# EAGLE schematic MRRobotBadge (EAGLE 9.0.0)

## Sheet 1 of 4
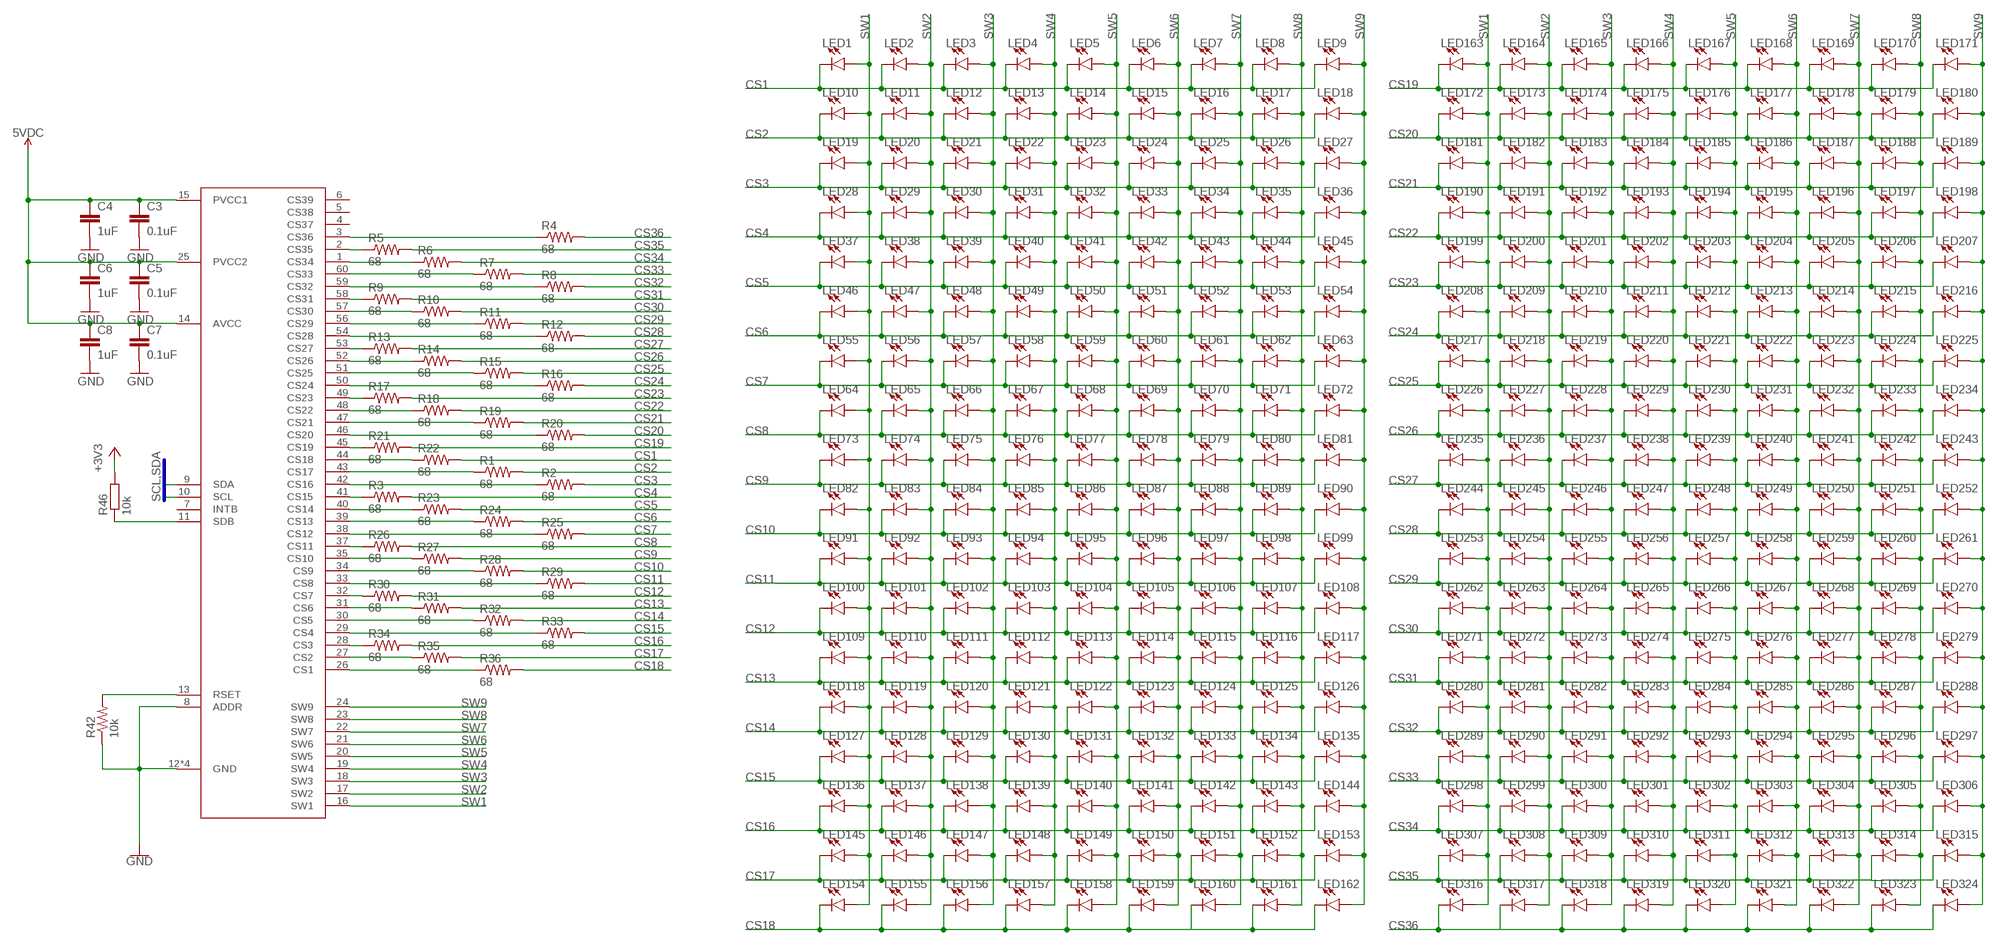
[diagram p0: schematic, sheet 1]

### Parts
C3  0.1uF  C-EUC0805K  [C0805K]
C4  1uF  C-EUC0805K  [C0805K]
C5  0.1uF  C-EUC0805K  [C0805K]
C6  1uF  C-EUC0805K  [C0805K]
C7  0.1uF  C-EUC0805K  [C0805K]
C8  1uF  C-EUC0805K  [C0805K]
LED1  LED0603  [LED-0603]
LED2  LED0603  [LED-0603]
LED3  LED0603  [LED-0603]
LED4  LED0603  [LED-0603]
LED5  LED0603  [LED-0603]
LED6  LED0603  [LED-0603]
LED7  LED0603  [LED-0603]
LED8  LED0603  [LED-0603]
LED9  LED0603  [LED-0603]
LED10  LED0603  [LED-0603]
LED11  LED0603  [LED-0603]
LED12  LED0603  [LED-0603]
LED13  LED0603  [LED-0603]
LED14  LED0603  [LED-0603]
LED15  LED0603  [LED-0603]
LED16  LED0603  [LED-0603]
LED17  LED0603  [LED-0603]
LED18  LED0603  [LED-0603]
LED19  LED0603  [LED-0603]
LED20  LED0603  [LED-0603]
LED21  LED0603  [LED-0603]
LED22  LED0603  [LED-0603]
LED23  LED0603  [LED-0603]
LED24  LED0603  [LED-0603]
LED25  LED0603  [LED-0603]
LED26  LED0603  [LED-0603]
LED27  LED0603  [LED-0603]
LED28  LED0603  [LED-0603]
LED29  LED0603  [LED-0603]
LED30  LED0603  [LED-0603]
LED31  LED0603  [LED-0603]
LED32  LED0603  [LED-0603]
LED33  LED0603  [LED-0603]
LED34  LED0603  [LED-0603]
LED35  LED0603  [LED-0603]
LED36  LED0603  [LED-0603]
LED37  LED0603  [LED-0603]
LED38  LED0603  [LED-0603]
LED39  LED0603  [LED-0603]
LED40  LED0603  [LED-0603]
LED41  LED0603  [LED-0603]
LED42  LED0603  [LED-0603]
LED43  LED0603  [LED-0603]
LED44  LED0603  [LED-0603]
LED45  LED0603  [LED-0603]
LED46  LED0603  [LED-0603]
LED47  LED0603  [LED-0603]
LED48  LED0603  [LED-0603]
LED49  LED0603  [LED-0603]
LED50  LED0603  [LED-0603]
LED51  LED0603  [LED-0603]
LED52  LED0603  [LED-0603]
LED53  LED0603  [LED-0603]
LED54  LED0603  [LED-0603]
LED55  LED0603  [LED-0603]
LED56  LED0603  [LED-0603]
LED57  LED0603  [LED-0603]
LED58  LED0603  [LED-0603]
LED59  LED0603  [LED-0603]
LED60  LED0603  [LED-0603]
LED61  LED0603  [LED-0603]
LED62  LED0603  [LED-0603]
LED63  LED0603  [LED-0603]
LED64  LED0603  [LED-0603]
LED65  LED0603  [LED-0603]
LED66  LED0603  [LED-0603]
LED67  LED0603  [LED-0603]
LED68  LED0603  [LED-0603]
LED69  LED0603  [LED-0603]
LED70  LED0603  [LED-0603]
LED71  LED0603  [LED-0603]
LED72  LED0603  [LED-0603]
LED73  LED0603  [LED-0603]
LED74  LED0603  [LED-0603]
LED75  LED0603  [LED-0603]
LED76  LED0603  [LED-0603]
LED77  LED0603  [LED-0603]
LED78  LED0603  [LED-0603]
LED79  LED0603  [LED-0603]
LED80  LED0603  [LED-0603]
LED81  LED0603  [LED-0603]
LED82  LED0603  [LED-0603]
LED83  LED0603  [LED-0603]
LED84  LED0603  [LED-0603]
LED85  LED0603  [LED-0603]
LED86  LED0603  [LED-0603]
LED87  LED0603  [LED-0603]
LED88  LED0603  [LED-0603]
LED89  LED0603  [LED-0603]
LED90  LED0603  [LED-0603]
LED91  LED0603  [LED-0603]
LED92  LED0603  [LED-0603]
LED93  LED0603  [LED-0603]
LED94  LED0603  [LED-0603]
LED95  LED0603  [LED-0603]
LED96  LED0603  [LED-0603]
LED97  LED0603  [LED-0603]
LED98  LED0603  [LED-0603]
LED99  LED0603  [LED-0603]
LED100  LED0603  [LED-0603]
LED101  LED0603  [LED-0603]
LED102  LED0603  [LED-0603]
LED103  LED0603  [LED-0603]
LED104  LED0603  [LED-0603]
LED105  LED0603  [LED-0603]
LED106  LED0603  [LED-0603]
LED107  LED0603  [LED-0603]
LED108  LED0603  [LED-0603]
LED109  LED0603  [LED-0603]
LED110  LED0603  [LED-0603]
LED111  LED0603  [LED-0603]
LED112  LED0603  [LED-0603]
LED113  LED0603  [LED-0603]
LED114  LED0603  [LED-0603]
LED115  LED0603  [LED-0603]
LED116  LED0603  [LED-0603]
LED117  LED0603  [LED-0603]
LED118  LED0603  [LED-0603]
LED119  LED0603  [LED-0603]
LED120  LED0603  [LED-0603]
LED121  LED0603  [LED-0603]
LED122  LED0603  [LED-0603]
LED123  LED0603  [LED-0603]
LED124  LED0603  [LED-0603]
LED125  LED0603  [LED-0603]
LED126  LED0603  [LED-0603]
LED127  LED0603  [LED-0603]
LED128  LED0603  [LED-0603]
LED129  LED0603  [LED-0603]
LED130  LED0603  [LED-0603]
LED131  LED0603  [LED-0603]
LED132  LED0603  [LED-0603]
LED133  LED0603  [LED-0603]
LED134  LED0603  [LED-0603]
LED135  LED0603  [LED-0603]
LED136  LED0603  [LED-0603]
LED137  LED0603  [LED-0603]
LED138  LED0603  [LED-0603]
LED139  LED0603  [LED-0603]
LED140  LED0603  [LED-0603]
LED141  LED0603  [LED-0603]
LED142  LED0603  [LED-0603]
LED143  LED0603  [LED-0603]
LED144  LED0603  [LED-0603]
LED145  LED0603  [LED-0603]
LED146  LED0603  [LED-0603]
LED147  LED0603  [LED-0603]
LED148  LED0603  [LED-0603]
LED149  LED0603  [LED-0603]
LED150  LED0603  [LED-0603]
LED151  LED0603  [LED-0603]
LED152  LED0603  [LED-0603]
LED153  LED0603  [LED-0603]
LED154  LED0603  [LED-0603]
LED155  LED0603  [LED-0603]
LED156  LED0603  [LED-0603]
LED157  LED0603  [LED-0603]
LED158  LED0603  [LED-0603]
LED159  LED0603  [LED-0603]
LED160  LED0603  [LED-0603]
LED161  LED0603  [LED-0603]
LED162  LED0603  [LED-0603]
LED163  LED0603  [LED-0603]
LED164  LED0603  [LED-0603]
LED165  LED0603  [LED-0603]
LED166  LED0603  [LED-0603]
LED167  LED0603  [LED-0603]
LED168  LED0603  [LED-0603]
LED169  LED0603  [LED-0603]
LED170  LED0603  [LED-0603]
LED171  LED0603  [LED-0603]
LED172  LED0603  [LED-0603]
LED173  LED0603  [LED-0603]
LED174  LED0603  [LED-0603]
LED175  LED0603  [LED-0603]
LED176  LED0603  [LED-0603]
LED177  LED0603  [LED-0603]
LED178  LED0603  [LED-0603]
LED179  LED0603  [LED-0603]
LED180  LED0603  [LED-0603]
LED181  LED0603  [LED-0603]
LED182  LED0603  [LED-0603]
LED183  LED0603  [LED-0603]
LED184  LED0603  [LED-0603]
LED185  LED0603  [LED-0603]
LED186  LED0603  [LED-0603]
LED187  LED0603  [LED-0603]
LED188  LED0603  [LED-0603]
LED189  LED0603  [LED-0603]
LED190  LED0603  [LED-0603]
LED191  LED0603  [LED-0603]
LED192  LED0603  [LED-0603]
LED193  LED0603  [LED-0603]
LED194  LED0603  [LED-0603]
LED195  LED0603  [LED-0603]
LED196  LED0603  [LED-0603]
LED197  LED0603  [LED-0603]
LED198  LED0603  [LED-0603]
LED199  LED0603  [LED-0603]
LED200  LED0603  [LED-0603]
LED201  LED0603  [LED-0603]
LED202  LED0603  [LED-0603]
LED203  LED0603  [LED-0603]
LED204  LED0603  [LED-0603]
LED205  LED0603  [LED-0603]
LED206  LED0603  [LED-0603]
LED207  LED0603  [LED-0603]
LED208  LED0603  [LED-0603]
LED209  LED0603  [LED-0603]
LED210  LED0603  [LED-0603]
LED211  LED0603  [LED-0603]
LED212  LED0603  [LED-0603]
LED213  LED0603  [LED-0603]
LED214  LED0603  [LED-0603]
LED215  LED0603  [LED-0603]
LED216  LED0603  [LED-0603]
LED217  LED0603  [LED-0603]
LED218  LED0603  [LED-0603]
LED219  LED0603  [LED-0603]
LED220  LED0603  [LED-0603]
LED221  LED0603  [LED-0603]
LED222  LED0603  [LED-0603]
LED223  LED0603  [LED-0603]
LED224  LED0603  [LED-0603]
LED225  LED0603  [LED-0603]
LED226  LED0603  [LED-0603]
LED227  LED0603  [LED-0603]
LED228  LED0603  [LED-0603]
LED229  LED0603  [LED-0603]
LED230  LED0603  [LED-0603]
LED231  LED0603  [LED-0603]
LED232  LED0603  [LED-0603]
LED233  LED0603  [LED-0603]
LED234  LED0603  [LED-0603]
LED235  LED0603  [LED-0603]
LED236  LED0603  [LED-0603]
LED237  LED0603  [LED-0603]
LED238  LED0603  [LED-0603]
LED239  LED0603  [LED-0603]
LED240  LED0603  [LED-0603]
LED241  LED0603  [LED-0603]
LED242  LED0603  [LED-0603]
LED243  LED0603  [LED-0603]
LED244  LED0603  [LED-0603]
LED245  LED0603  [LED-0603]
LED246  LED0603  [LED-0603]
LED247  LED0603  [LED-0603]
LED248  LED0603  [LED-0603]
LED249  LED0603  [LED-0603]
LED250  LED0603  [LED-0603]
LED251  LED0603  [LED-0603]
LED252  LED0603  [LED-0603]
LED253  LED0603  [LED-0603]
LED254  LED0603  [LED-0603]
LED255  LED0603  [LED-0603]
LED256  LED0603  [LED-0603]
LED257  LED0603  [LED-0603]
LED258  LED0603  [LED-0603]
LED259  LED0603  [LED-0603]
LED260  LED0603  [LED-0603]
LED261  LED0603  [LED-0603]
LED262  LED0603  [LED-0603]
LED263  LED0603  [LED-0603]
LED264  LED0603  [LED-0603]
LED265  LED0603  [LED-0603]
LED266  LED0603  [LED-0603]
LED267  LED0603  [LED-0603]
LED268  LED0603  [LED-0603]
LED269  LED0603  [LED-0603]
LED270  LED0603  [LED-0603]
LED271  LED0603  [LED-0603]
LED272  LED0603  [LED-0603]
LED273  LED0603  [LED-0603]
LED274  LED0603  [LED-0603]
LED275  LED0603  [LED-0603]
LED276  LED0603  [LED-0603]
LED277  LED0603  [LED-0603]
LED278  LED0603  [LED-0603]
LED279  LED0603  [LED-0603]
LED280  LED0603  [LED-0603]
LED281  LED0603  [LED-0603]
LED282  LED0603  [LED-0603]
LED283  LED0603  [LED-0603]
LED284  LED0603  [LED-0603]
LED285  LED0603  [LED-0603]
LED286  LED0603  [LED-0603]
LED287  LED0603  [LED-0603]
LED288  LED0603  [LED-0603]
LED289  LED0603  [LED-0603]
LED290  LED0603  [LED-0603]
LED291  LED0603  [LED-0603]
LED292  LED0603  [LED-0603]
LED293  LED0603  [LED-0603]
LED294  LED0603  [LED-0603]
LED295  LED0603  [LED-0603]
LED296  LED0603  [LED-0603]
LED297  LED0603  [LED-0603]
LED298  LED0603  [LED-0603]
LED299  LED0603  [LED-0603]
LED300  LED0603  [LED-0603]
LED301  LED0603  [LED-0603]
LED302  LED0603  [LED-0603]
LED303  LED0603  [LED-0603]
LED304  LED0603  [LED-0603]
LED305  LED0603  [LED-0603]
LED306  LED0603  [LED-0603]
LED307  LED0603  [LED-0603]
LED308  LED0603  [LED-0603]
LED309  LED0603  [LED-0603]
LED310  LED0603  [LED-0603]
LED311  LED0603  [LED-0603]
LED312  LED0603  [LED-0603]
LED313  LED0603  [LED-0603]
LED314  LED0603  [LED-0603]
LED315  LED0603  [LED-0603]
LED316  LED0603  [LED-0603]
LED317  LED0603  [LED-0603]
LED318  LED0603  [LED-0603]
LED319  LED0603  [LED-0603]
LED320  LED0603  [LED-0603]
LED321  LED0603  [LED-0603]
LED322  LED0603  [LED-0603]
LED323  LED0603  [LED-0603]
LED324  LED0603  [LED-0603]
R1  68  R-US_R0805  [R0805]
R2  68  R-US_R0805  [R0805]
R3  68  R-US_R0805  [R0805]
R4  68  R-US_R0805  [R0805]
R5  68  R-US_R0805  [R0805]
R6  68  R-US_R0805  [R0805]
R7  68  R-US_R0805  [R0805]
R8  68  R-US_R0805  [R0805]
R9  68  R-US_R0805  [R0805]
R10  68  R-US_R0805  [R0805]
R11  68  R-US_R0805  [R0805]
R12  68  R-US_R0805  [R0805]
R13  68  R-US_R0805  [R0805]
R14  68  R-US_R0805  [R0805]
R15  68  R-US_R0805  [R0805]
R16  68  R-US_R0805  [R0805]
R17  68  R-US_R0805  [R0805]
R18  68  R-US_R0805  [R0805]
R19  68  R-US_R0805  [R0805]
R20  68  R-US_R0805  [R0805]
R21  68  R-US_R0805  [R0805]
R22  68  R-US_R0805  [R0805]
R23  68  R-US_R0805  [R0805]
R24  68  R-US_R0805  [R0805]
R25  68  R-US_R0805  [R0805]
R26  68  R-US_R0805  [R0805]
R27  68  R-US_R0805  [R0805]
R28  68  R-US_R0805  [R0805]
R29  68  R-US_R0805  [R0805]
R30  68  R-US_R0805  [R0805]
R31  68  R-US_R0805  [R0805]
R32  68  R-US_R0805  [R0805]
R33  68  R-US_R0805  [R0805]
R34  68  R-US_R0805  [R0805]
R35  68  R-US_R0805  [R0805]
R36  68  R-US_R0805  [R0805]
R42  10k  R-US_R0805  [R0805]
R46  10k  R-EU_R0805  [R0805]
U1  IS31FL3741_QFN60  [QFN60]

### Nets
3V3: R46.2 ; supply symbol labelled +3V3 ; also sheet 2,3
5VDC: C3.1 C4.1 C5.1 C6.1 C7.1 C8.1 U1.14(AVCC) U1.15(PVCC1) U1.25(PVCC2) ; also sheet 2
CS1: LED1.C LED2.C LED3.C LED4.C LED5.C LED6.C LED7.C LED8.C LED9.C R22.2
CS2: LED10.C LED11.C LED12.C LED13.C LED14.C LED15.C LED16.C LED17.C LED18.C R1.2
CS3: LED19.C LED20.C LED21.C LED22.C LED23.C LED24.C LED25.C LED26.C LED27.C R2.2
CS4: LED28.C LED29.C LED30.C LED31.C LED32.C LED33.C LED34.C LED35.C LED36.C R3.2
CS5: LED37.C LED38.C LED39.C LED40.C LED41.C LED42.C LED43.C LED44.C LED45.C R23.2
CS6: LED46.C LED47.C LED48.C LED49.C LED50.C LED51.C LED52.C LED53.C LED54.C R24.2
CS7: LED55.C LED56.C LED57.C LED58.C LED59.C LED60.C LED61.C LED62.C LED63.C R25.2
CS8: LED64.C LED65.C LED66.C LED67.C LED68.C LED69.C LED70.C LED71.C LED72.C R26.2
CS9: LED73.C LED74.C LED75.C LED76.C LED77.C LED78.C LED79.C LED80.C LED81.C R27.2
CS10: LED82.C LED83.C LED84.C LED85.C LED86.C LED87.C LED88.C LED89.C LED90.C R28.2
CS11: LED91.C LED92.C LED93.C LED94.C LED95.C LED96.C LED97.C LED98.C LED99.C R29.2
CS12: LED100.C LED101.C LED102.C LED103.C LED104.C LED105.C LED106.C LED107.C LED108.C R30.2
CS13: LED109.C LED110.C LED111.C LED112.C LED113.C LED114.C LED115.C LED116.C LED117.C R31.2
CS14: LED118.C LED119.C LED120.C LED121.C LED122.C LED123.C LED124.C LED125.C LED126.C R32.2
CS15: LED127.C LED128.C LED129.C LED130.C LED131.C LED132.C LED133.C LED134.C LED135.C R33.2
CS16: LED136.C LED137.C LED138.C LED139.C LED140.C LED141.C LED142.C LED143.C LED144.C R34.2
CS17: LED145.C LED146.C LED147.C LED148.C LED149.C LED150.C LED151.C LED152.C LED153.C R35.2
CS18: LED154.C LED155.C LED156.C LED157.C LED158.C LED159.C LED160.C LED161.C LED162.C R36.2
CS19: LED163.C LED164.C LED165.C LED166.C LED167.C LED168.C LED169.C LED170.C LED171.C R21.2
CS20: LED172.C LED173.C LED174.C LED175.C LED176.C LED177.C LED178.C LED179.C LED180.C R20.2
CS21: LED181.C LED182.C LED183.C LED184.C LED185.C LED186.C LED187.C LED188.C LED189.C R19.2
CS22: LED190.C LED191.C LED192.C LED193.C LED194.C LED195.C LED196.C LED197.C LED198.C R18.2
CS23: LED199.C LED200.C LED201.C LED202.C LED203.C LED204.C LED205.C LED206.C LED207.C R17.2
CS24: LED208.C LED209.C LED210.C LED211.C LED212.C LED213.C LED214.C LED215.C LED216.C R16.2
CS25: LED217.C LED218.C LED219.C LED220.C LED221.C LED222.C LED223.C LED224.C LED225.C R15.2
CS26: LED226.C LED227.C LED228.C LED229.C LED230.C LED231.C LED232.C LED233.C LED234.C R14.2
CS27: LED235.C LED236.C LED237.C LED238.C LED239.C LED240.C LED241.C LED242.C LED243.C R13.2
CS28: LED244.C LED245.C LED246.C LED247.C LED248.C LED249.C LED250.C LED251.C LED252.C R12.2
CS29: LED253.C LED254.C LED255.C LED256.C LED257.C LED258.C LED259.C LED260.C LED261.C R11.2
CS30: LED262.C LED263.C LED264.C LED265.C LED266.C LED267.C LED268.C LED269.C LED270.C R10.2
CS31: LED271.C LED272.C LED273.C LED274.C LED275.C LED276.C LED277.C LED278.C LED279.C R9.2
CS32: LED280.C LED281.C LED282.C LED283.C LED284.C LED285.C LED286.C LED287.C LED288.C R8.2
CS33: LED289.C LED290.C LED291.C LED292.C LED293.C LED294.C LED295.C LED296.C LED297.C R7.2
CS34: LED298.C LED299.C LED300.C LED301.C LED302.C LED303.C LED304.C LED305.C LED306.C R6.2
CS35: LED307.C LED308.C LED309.C LED310.C LED311.C LED312.C LED313.C LED314.C LED315.C R5.2
CS36: LED316.C LED317.C LED318.C LED319.C LED320.C LED321.C LED322.C LED323.C LED324.C R4.2
GND: C3.2 C4.2 C5.2 C6.2 C7.2 C8.2 R42.1 U1.8(ADDR) U1.12(GND) U1.36(GND) U1.55(GND) U1.PAD(GND) ; also sheet 2,3
N$1: R36.1 U1.26(CS1)
N$2: R35.1 U1.27(CS2)
N$3: R34.1 U1.28(CS3)
N$4: R33.1 U1.29(CS4)
N$5: R32.1 U1.30(CS5)
N$6: R31.1 U1.31(CS6)
N$7: R30.1 U1.32(CS7)
N$8: R29.1 U1.33(CS8)
N$9: R28.1 U1.34(CS9)
N$10: R27.1 U1.35(CS10)
N$11: R26.1 U1.37(CS11)
N$12: R25.1 U1.38(CS12)
N$13: R24.1 U1.39(CS13)
N$14: R23.1 U1.40(CS14)
N$15: R3.1 U1.41(CS15)
N$16: R22.1 U1.44(CS18)
N$17: R2.1 U1.42(CS16)
N$18: R1.1 U1.43(CS17)
N$19: R21.1 U1.45(CS19)
N$20: R20.1 U1.46(CS20)
N$21: R19.1 U1.47(CS21)
N$22: R18.1 U1.48(CS22)
N$23: R17.1 U1.49(CS23)
N$24: R16.1 U1.50(CS24)
N$25: R15.1 U1.51(CS25)
N$26: R14.1 U1.52(CS26)
N$27: R13.1 U1.53(CS27)
N$28: R12.1 U1.54(CS28)
N$29: R11.1 U1.56(CS29)
N$30: R10.1 U1.57(CS30)
N$31: R9.1 U1.58(CS31)
N$32: R8.1 U1.59(CS32)
N$33: R7.1 U1.60(CS33)
N$34: R6.1 U1.1(CS34)
N$35: R5.1 U1.2(CS35)
N$36: R4.1 U1.3(CS36)
N$43: R46.1 U1.11(SDB)
N$44: R42.2 U1.13(RSET)
SCL: U1.10(SCL) ; also sheet 3
SDA: U1.9(SDA) ; also sheet 3
SW1: LED1.A LED10.A LED19.A LED28.A LED37.A LED46.A LED55.A LED64.A LED73.A LED82.A LED91.A LED100.A LED109.A LED118.A LED127.A LED136.A LED145.A LED154.A LED163.A LED172.A LED181.A LED190.A LED199.A LED208.A LED217.A LED226.A LED235.A LED244.A LED253.A LED262.A LED271.A LED280.A LED289.A LED298.A LED307.A LED316.A U1.16(SW1)
SW2: LED2.A LED11.A LED20.A LED29.A LED38.A LED47.A LED56.A LED65.A LED74.A LED83.A LED92.A LED101.A LED110.A LED119.A LED128.A LED137.A LED146.A LED155.A LED164.A LED173.A LED182.A LED191.A LED200.A LED209.A LED218.A LED227.A LED236.A LED245.A LED254.A LED263.A LED272.A LED281.A LED290.A LED299.A LED308.A LED317.A U1.17(SW2)
SW3: LED3.A LED12.A LED21.A LED30.A LED39.A LED48.A LED57.A LED66.A LED75.A LED84.A LED93.A LED102.A LED111.A LED120.A LED129.A LED138.A LED147.A LED156.A LED165.A LED174.A LED183.A LED192.A LED201.A LED210.A LED219.A LED228.A LED237.A LED246.A LED255.A LED264.A LED273.A LED282.A LED291.A LED300.A LED309.A LED318.A U1.18(SW3)
SW4: LED4.A LED13.A LED22.A LED31.A LED40.A LED49.A LED58.A LED67.A LED76.A LED85.A LED94.A LED103.A LED112.A LED121.A LED130.A LED139.A LED148.A LED157.A LED166.A LED175.A LED184.A LED193.A LED202.A LED211.A LED220.A LED229.A LED238.A LED247.A LED256.A LED265.A LED274.A LED283.A LED292.A LED301.A LED310.A LED319.A U1.19(SW4)
SW5: LED5.A LED14.A LED23.A LED32.A LED41.A LED50.A LED59.A LED68.A LED77.A LED86.A LED95.A LED104.A LED113.A LED122.A LED131.A LED140.A LED149.A LED158.A LED167.A LED176.A LED185.A LED194.A LED203.A LED212.A LED221.A LED230.A LED239.A LED248.A LED257.A LED266.A LED275.A LED284.A LED293.A LED302.A LED311.A LED320.A U1.20(SW5)
SW6: LED6.A LED15.A LED24.A LED33.A LED42.A LED51.A LED60.A LED69.A LED78.A LED87.A LED96.A LED105.A LED114.A LED123.A LED132.A LED141.A LED150.A LED159.A LED168.A LED177.A LED186.A LED195.A LED204.A LED213.A LED222.A LED231.A LED240.A LED249.A LED258.A LED267.A LED276.A LED285.A LED294.A LED303.A LED312.A LED321.A U1.21(SW6)
SW7: LED7.A LED16.A LED25.A LED34.A LED43.A LED52.A LED61.A LED70.A LED79.A LED88.A LED97.A LED106.A LED115.A LED124.A LED133.A LED142.A LED151.A LED160.A LED169.A LED178.A LED187.A LED196.A LED205.A LED214.A LED223.A LED232.A LED241.A LED250.A LED259.A LED268.A LED277.A LED286.A LED295.A LED304.A LED313.A LED322.A U1.22(SW7)
SW8: LED8.A LED17.A LED26.A LED35.A LED44.A LED53.A LED62.A LED71.A LED80.A LED89.A LED98.A LED107.A LED116.A LED125.A LED134.A LED143.A LED152.A LED161.A LED170.A LED179.A LED188.A LED197.A LED206.A LED215.A LED224.A LED233.A LED242.A LED251.A LED260.A LED269.A LED278.A LED287.A LED296.A LED305.A LED314.A LED323.A U1.23(SW8)
SW9: LED9.A LED18.A LED27.A LED36.A LED45.A LED54.A LED63.A LED72.A LED81.A LED90.A LED99.A LED108.A LED117.A LED126.A LED135.A LED144.A LED153.A LED162.A LED171.A LED180.A LED189.A LED198.A LED207.A LED216.A LED225.A LED234.A LED243.A LED252.A LED261.A LED270.A LED279.A LED288.A LED297.A LED306.A LED315.A LED324.A U1.24(SW9)
Unconnected: U1.4(CS37) U1.5(CS38) U1.6(CS39) U1.7(INTB)

### Buses
SCL,SDA

## Sheet 2 of 4
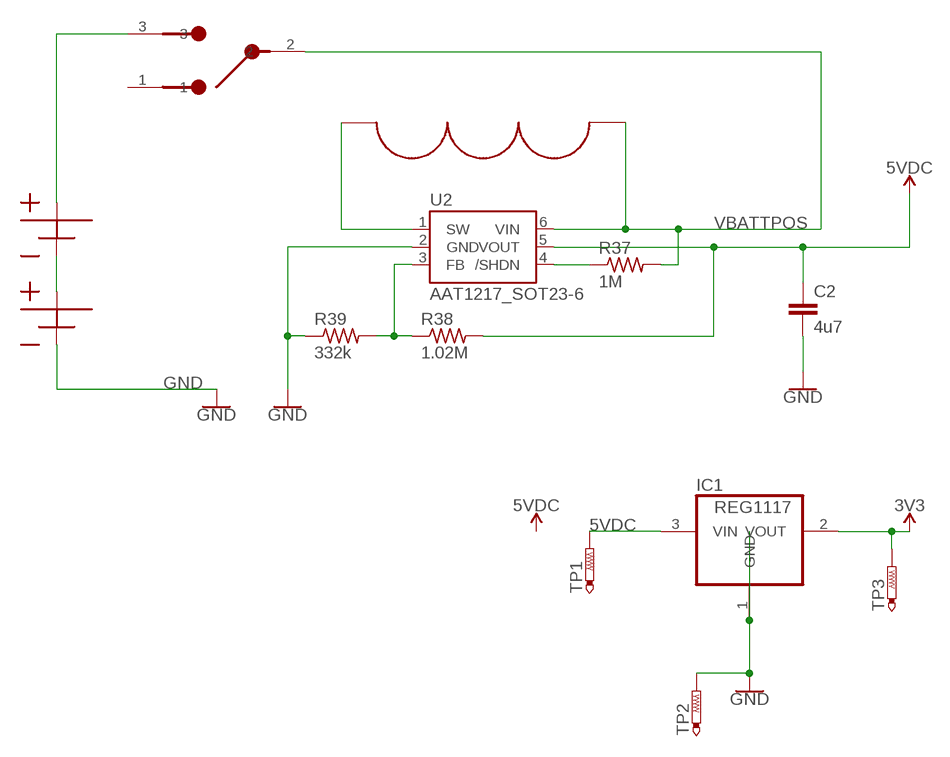
[diagram p1: schematic, sheet 2]

### Parts
C2  4u7  C-EUC0805  [C0805]
IC1  REG1117  [SOT223]
R37  1M  R-US_R0805  [R0805]
R38  1.02M  R-US_R0805  [R0805]
R39  332k  R-US_R0805  [R0805]
TP1  PTR1B1,27  [B1,27]
TP2  PTR1B1,27  [B1,27]
TP3  PTR1B1,27  [B1,27]
U2  AAT1217_SOT23-6  [SOT23-6]
U$1  CDRH4D28C  [CDRH4D28C]
U$2  KEYSTONE1028  [KEYSTONE1028]
U$3  KEYSTONE1028  [KEYSTONE1028]
U$4  ALPSSLIDESW  [SWITCH-SSSS810701]

### Nets
3V3: IC1.2(VOUT) TP3.TP ; also sheet 1,3
5VDC: C2.1 IC1.3(VIN) R38.2 TP1.TP U2.5(VOUT) ; also sheet 1
GND: C2.2 IC1.1(GND) R39.1 TP2.TP U2.2(GND) U$3.NEG ; also sheet 1,3
N$37: U$2.NEG U$3.POS
N$38: R37.1 U2.4(/SHDN)
N$39: U$2.POS U$4.3
N$40: U2.1(SW) U$1.1
N$42: R38.1 R39.2 U2.3(FB)
VBATTPOS: R37.2 U2.6(VIN) U$1.2 U$4.2
Unconnected: U$4.1

## Sheet 3 of 4
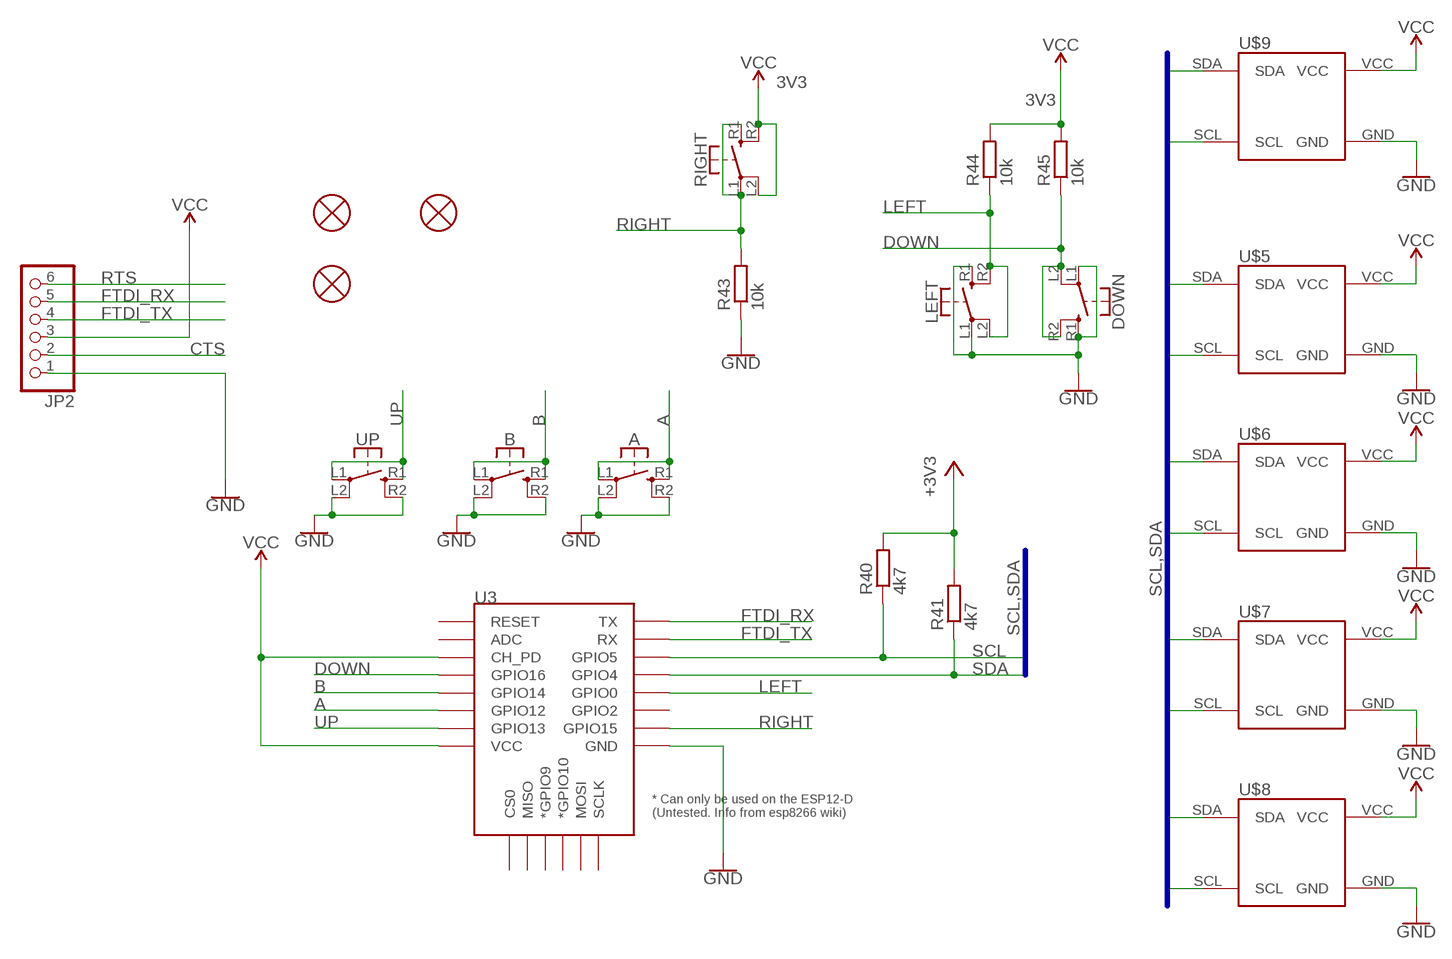
[diagram p2: schematic, sheet 3]

### Parts
A  MOMENTARYSW  [SWITCHMOMENTARY]
B  MOMENTARYSW  [SWITCHMOMENTARY]
DOWN  MOMENTARYSW  [SWITCHMOMENTARY]
FID1  LARGEFIDUCIAL  [FIDUCIAL]
JP2  PINHD-1X6  [1X06]
LEFT  MOMENTARYSW  [SWITCHMOMENTARY]
R40  4k7  R-EU_R0805  [R0805]
R41  4k7  R-EU_R0805  [R0805]
R43  10k  R-EU_R0805  [R0805]
R44  10k  R-EU_R0805  [R0805]
R45  10k  R-EU_R0805  [R0805]
RIGHT  MOMENTARYSW  [SWITCHMOMENTARY]
U3  ESP12ESMD  [ESP12E-SMD]
U$5  SHITTYADDONHEADER  [SHITTYHEADER]
U$6  SHITTYADDONHEADER  [SHITTYHEADER]
U$7  SHITTYADDONHEADER  [SHITTYHEADER]
U$8  SHITTYADDONHEADER  [SHITTYHEADER]
U$9  SHITTYADDONHEADER  [SHITTYHEADER]
U$10  LARGEFIDUCIAL  [FIDUCIAL]
U$11  LARGEFIDUCIAL  [FIDUCIAL]
UP  MOMENTARYSW  [SWITCHMOMENTARY]

### Nets
3V3: JP2.3 R40.2 R41.2 R44.2 R45.2 RIGHT.L2 RIGHT.R2 U3.CH_PD U3.VCC U$5.VCC U$6.VCC U$7.VCC U$8.VCC U$9.VCC ; supply symbol labelled VCC, +3V3 ; also sheet 1,2
A: A.L1 A.R1 U3.GPIO12
B: B.L1 B.R1 U3.GPIO14
CTS: JP2.2
DOWN: DOWN.L2 DOWN.R2 R45.1 U3.GPIO16
FTDI_RX: JP2.5 U3.TXD0(TX)
FTDI_TX: JP2.4 U3.RXD0(RX)
GND: A.L2 A.R2 B.L2 B.R2 DOWN.L1 DOWN.R1 JP2.1 LEFT.L1 LEFT.R1 R43.1 U3.GND U$5.GND U$6.GND U$7.GND U$8.GND U$9.GND UP.L2 UP.R2 ; also sheet 1,2
LEFT: LEFT.L2 LEFT.R2 R44.1 U3.GPIO0
RIGHT: R43.2 RIGHT.L1 RIGHT.R1 U3.GPIO15
RTS: JP2.6
SCL: R40.1 U3.GPIO5 U$5.SCL U$6.SCL U$7.SCL U$8.SCL U$9.SCL ; also sheet 1
SDA: R41.1 U3.GPIO4 U$5.SDA U$6.SDA U$7.SDA U$8.SDA U$9.SDA ; also sheet 1
UP: U3.GPIO13 UP.L1 UP.R1
Unconnected: U3.ADC U3.CS0 U3.GPIO2 U3.GPIO9(*GPIO9) U3.GPIO10(*GPIO10) U3.MISO U3.MOSI U3.RESET U3.SCLK

### Buses
SCL,SDA

## Sheet 4 of 4

## Library data of the parts
A B DOWN LEFT RIGHT UP = MRRobotBadge:MOMENTARYSW
C2-C8 = rcl:C-EU: CAPACITOR, European symbol; SPICEPREFIX: C
FID1 U$10 U$11 = MRRobotBadge:LARGEFIDUCIAL
IC1 = burr-brown:REG1117: 800mA and 1A Low Dropout (LDO) Positive Regulator 1.8V, 2.5V, 2.85V, 3.3V, 5V, and Adj; MPN: REG1117; OC_FARNELL: 1097566; OC_NEWARK: 14P6981
JP2 = pinhead:PINHD-1X6: PIN HEADER
LED1-LED324 = SparkFun-LED:LED: LED (Generic) Standard schematic elements and footprints for 5mm, 3mm, 1206, and 0603 sized LEDs. Generic LEDs with no color specified.
R1-R39 R42 = rcl:R-US_: RESISTOR, American symbol; SPICEPREFIX: R
R40 R41 R43-R46 = rcl:R-EU_: RESISTOR, European symbol; SPICEPREFIX: R
TP1-TP3 = testpad:PTR1: TEST PIN
U1 = MRRobotBadge:IS31FL3741_QFN60: ISSI IS31FL3741 QFN-60
U2 = MRRobotBadge:AAT1217_SOT23-6
U3 = esp8266modules:ESP12E: ESP12E Module
U$1 = MRRobotBadge:CDRH4D28C
U$2 U$3 = MRRobotBadge:KEYSTONE1028
U$4 = TindieBadge:ALPSSLIDESW
U$5-U$9 = MRRobotBadge:SHITTYADDONHEADER